# EAGLE design Adafruit EZ-Link Shield v1.1 (EAGLE 6.3)
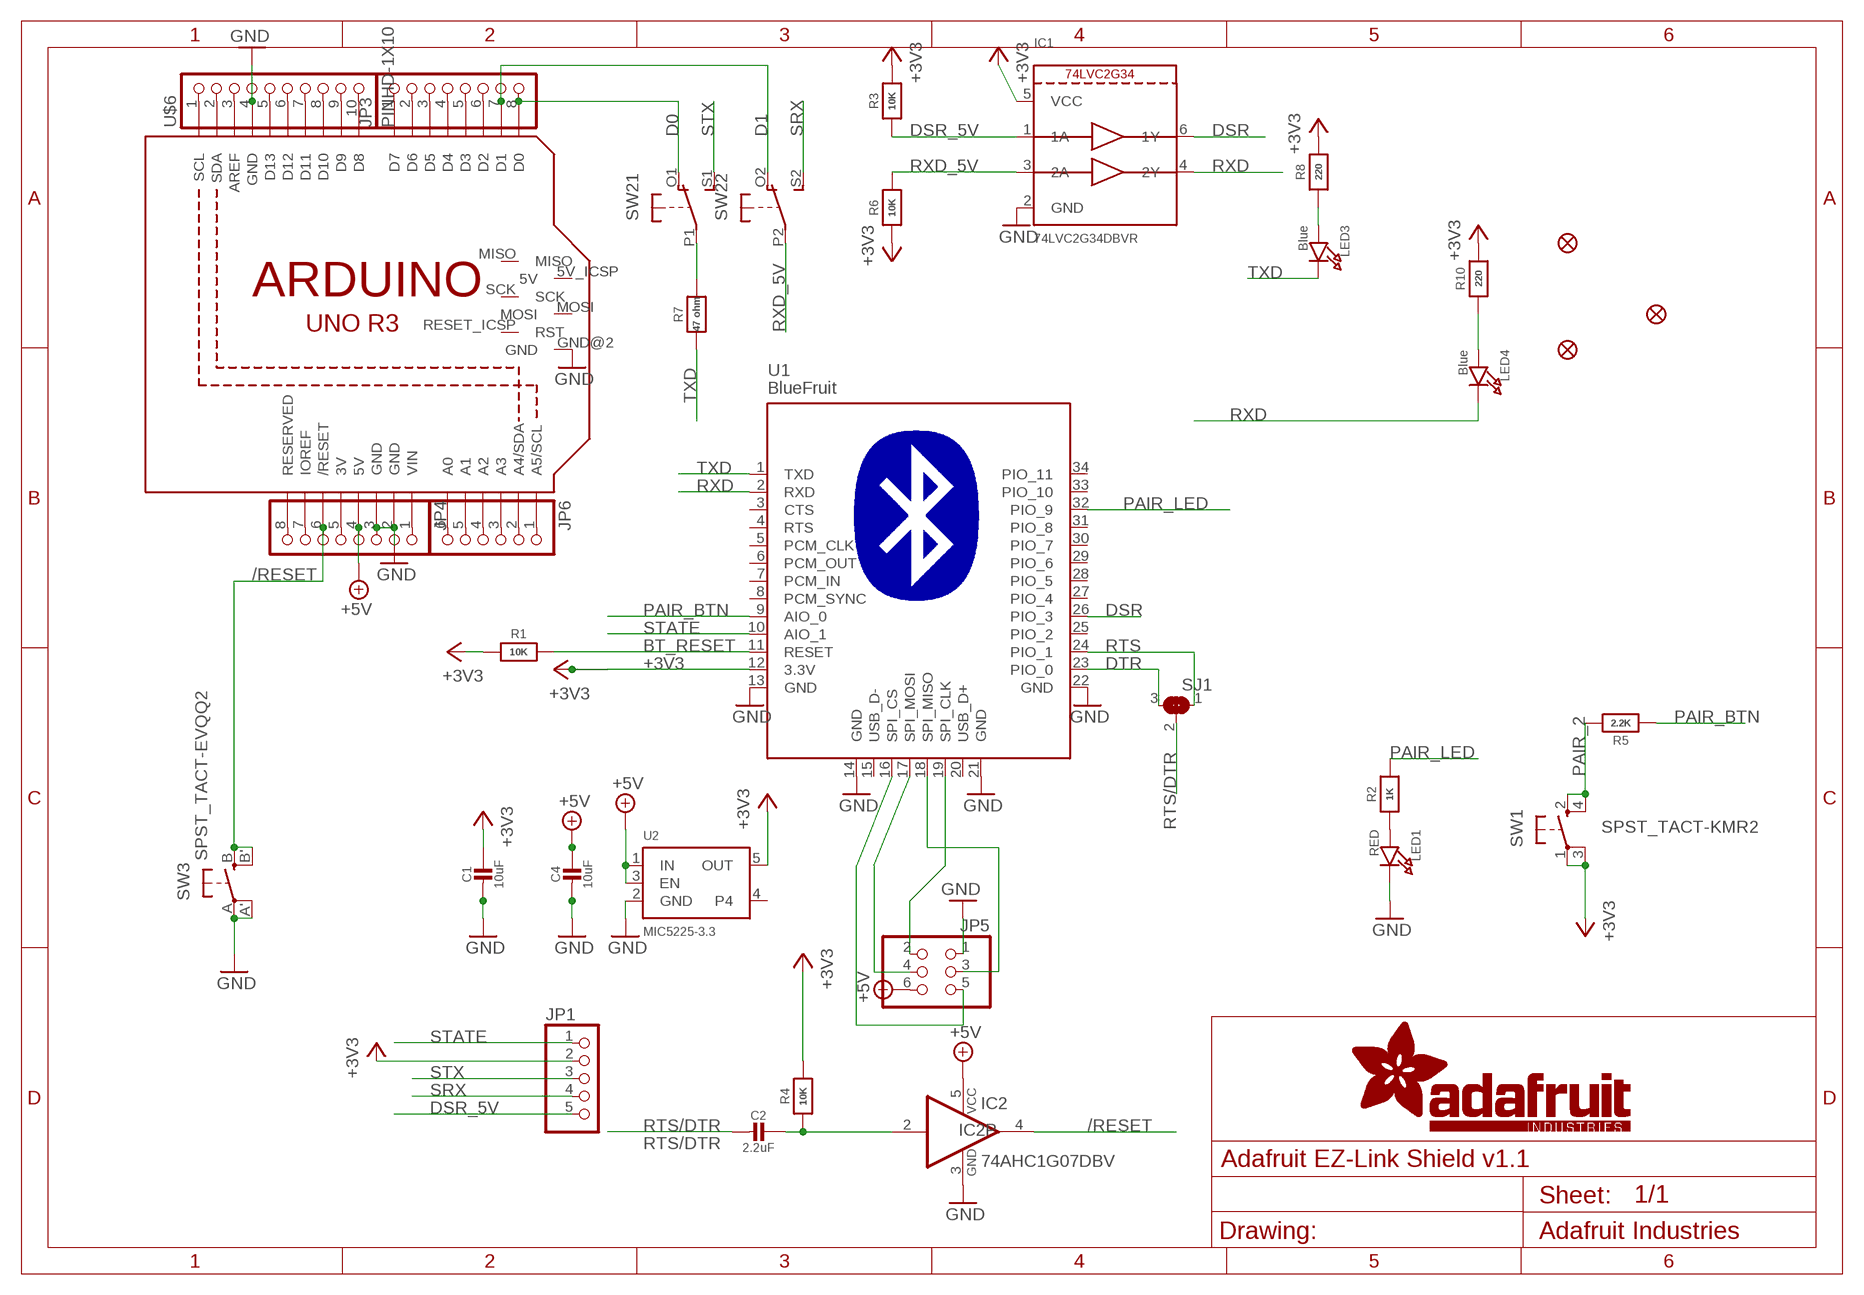
[diagram p0: schematic, sheet 1]

## Parts
C1  10uF  CAP_CERAMIC0805-NOOUTLINE  [0805-NO]
C2  2.2uF  CAP_CERAMIC0805-NOOUTLINE  [0805-NO]
C4  10uF  CAP_CERAMIC0805-NOOUTLINE  [0805-NO]
FID1  FIDUCIAL""  [FIDUCIAL_1MM]
FID2  FIDUCIAL""  [FIDUCIAL_1MM]
FID3  FIDUCIAL""  [FIDUCIAL_1MM]
IC1  74LVC2G34DBVR  [SOT23-6]
IC2  74AHC1G07DBV  [SOT23-5]
JP1  HEADER-1X570MIL  [1X05_ROUND_70]
JP3  PINHD-1X8BIG  [1X08-BIG]
JP4  PINHD-1X8BIG  [1X08-BIG]
JP5  HEADER-2X3  [2X03_ROUND_70MIL]
JP6  PINHD-1X6B  [1X06-BIG]
LED1  RED  LED0805_NOOUTLINE  [CHIPLED_0805_NOOUTLINE]
LED3  Blue  LED0805_NOOUTLINE  [CHIPLED_0805_NOOUTLINE]
LED4  Blue  LED0805_NOOUTLINE  [CHIPLED_0805_NOOUTLINE]
R1  10K  RESISTOR0805_NOOUTLINE  [0805-NO]
R2  1K  RESISTOR0805_NOOUTLINE  [0805-NO]
R3  10K  RESISTOR_0805MP  [_0805MP]
R4  10K  RESISTOR0805_NOOUTLINE  [0805-NO]
R5  2.2K  RESISTOR0805_NOOUTLINE  [0805-NO]
R6  10K  RESISTOR_0805MP  [_0805MP]
R7  47 ohm  RESISTOR0805_NOOUTLINE  [0805-NO]
R8  220  RESISTOR0805_NOOUTLINE  [0805-NO]
R10  220  RESISTOR0805_NOOUTLINE  [0805-NO]
SJ1  SOLDERJUMPER_2WAY  [SOLDERJUMPER_2WAY_OPEN_NOPASTE]
SW1  SPST_TACT-KMR2  [KMR2]
SW2  DPDT-EG1390  [EG1390]
SW3  SPST_TACT-EVQQ2  [EVQ-Q2]
U1  BlueFruit  BLUETOOTH_MODULE  [BLUETOOTH_MODULE]
U2  MIC5225-3.3  VREG_SOT23-5  [SOT23-5]
U$5  ARDUINO_R3_ICSP  [ARDUINOR3_ICSP]
U$6  PINHD-1X10  [1X10-BIG]

## Nets
+3V3: C1.1 IC1.5(VCC) JP1.2 R1.1 R3.2 R4.2 R6.1 R8.2 R10.2 SW1.1(P) SW1.3(P1) U1.12(3.3V) U2.5(OUT)
+5V: C4.1 IC2.5(VCC) JP4.4 JP5.6 U2.1(IN) U2.3(EN) U$5.5V
/RESET: IC2.4(O) JP4.6 SW3.B'(S1) SW3.B(S) U$5.RESET(/RESET)
BT_RESET: R1.2 U1.11(RESET)
D0: JP3.8 SW2.O1(1:O) U$5.D0
D1: JP3.7 SW2.O2(2:O) U$5.D1
DSR: IC1.6(1Y) U1.26(PIO_3)
DSR_5V: IC1.1(1A) JP1.5 R3.1
DTR: SJ1.3 U1.23(PIO_0)
GND: C1.2 C4.2 IC1.2(GND) IC2.3(GND) JP4.2 JP4.3 JP5.1 LED1.C SW3.A'(P1) SW3.A(P) U1.13(GND) U1.14(GND) U1.21(GND) U1.22(GND) U2.2(GND) U$5.GND U$5.GND@1(GND) U$5.GND@2(GND) U$5.GND@3(GND) U$6.4
N$1: C2.1 IC2.2(I) R4.1
N$2: LED1.A R2.1
N$3: R7.2 SW2.P1(1:P)
N$4: JP3.1 U$5.D7
N$5: JP3.2 U$5.D6
N$6: LED3.A R8.1
N$8: JP3.3 U$5.D5
N$9: JP3.4 U$5.D4
N$10: LED4.A R10.1
N$11: JP3.5 U$5.D3
N$12: JP3.6 U$5.D2
N$13: JP4.1 U$5.VIN
N$14: JP4.5 U$5.3V
N$15: JP4.7 U$5.IOREF
N$16: JP4.8 U$5.RESERVED
N$17: JP6.1 U$5.A5(A5/SCL)
N$18: JP6.2 U$5.A4(A4/SDA)
N$19: JP6.3 U$5.A3
N$20: JP6.4 U$5.A2
N$21: JP6.5 U$5.A1
N$22: JP6.6 U$5.A0
N$23: U$5.SCL U$6.1
N$24: U$5.SDA U$6.2
N$25: U$5.AREF U$6.3
N$27: U$5.D13 U$6.5
N$28: U$5.D12 U$6.6
N$29: U$5.D11 U$6.7
N$30: U$5.D10 U$6.8
N$31: U$5.D9 U$6.9
N$32: U$5.D8 U$6.10
PAIR_2: R5.2 SW1.2(S) SW1.4(S1)
PAIR_BTN: R5.1 U1.9(AIO_0)
PAIR_LED: R2.2 U1.32(PIO_9)
RTS: SJ1.1 U1.24(PIO_1)
RTS/DTR: C2.2 SJ1.2
RXD: IC1.4(2Y) LED4.C U1.2(RXD)
RXD_5V: IC1.3(2A) R6.2 SW2.P2(2:P)
SPI_CLK: JP5.2 U1.19(SPI_CLK)
SPI_CS: JP5.5 U1.16(SPI_CS)
SPI_MISO: JP5.3 U1.18(SPI_MISO)
SPI_MOSI: JP5.4 U1.17(SPI_MOSI)
SRX: JP1.4 SW2.S2(2:S)
STATE: JP1.1 U1.10(AIO_1)
STX: JP1.3 SW2.S1(1:S)
TXD: LED3.C R7.1 U1.1(TXD)
Unconnected: U1.3(CTS) U1.4(RTS) U1.5(PCM_CLK) U1.6(PCM_OUT) U1.7(PCM_IN) U1.8(PCM_SYNC) U1.15(USB_D-) U1.20(USB_D+) U1.25(PIO_2) U1.27(PIO_4) U1.28(PIO_5) U1.29(PIO_6) U1.30(PIO_7) U1.31(PIO_8) U1.33(PIO_10) U1.34(PIO_11) U2.4 U$5.5V_ICSP(5V) U$5.MISO U$5.MOSI U$5.RESET_ICSP(RST) U$5.SCK

## Library data of the parts
C1 C2 C4 = microbuilder:CAP_CERAMIC: Ceramic Capacitors For new designs, use the packages preceded by an '_' character since they are more reliable: The following footprints should be used on most boards: _0402 - Standard footprint for regular board layouts _0603 - Standard footprint for regular board layouts _0805 - Standard footprint for regular board layouts _1206 - Standard footprint for regular board layouts For extremely tight-pitch boards where space is at a premium, the following 'micro-pitch' footprints can be used (smaller pads, no silkscreen outline, etc.): _0402MP - Micro-pitch footprint for very dense/compact boards _0603MP - Micro-pitch footprint for very dense/compact boards _0805MP - Micro-pitch footprint for very dense/compact boards _1206MP - Micro-pitch footprint for very dense/compact boards
FID1-FID3 = microbuilder:FIDUCIAL: Fiducial Alignment Points Various fiducial points for machine vision alignment.; BOM: EXCLUDE
IC1 = microbuilder:74LVC2G34
IC2 = 74xx-little-us:74*1G07: Single Buffer/Driver With Open-Drain Output
JP1 = microbuilder:HEADER-1X5: PIN HEADER
JP3 JP4 = adafruit:PINHD-1X8: PIN HEADER
JP5 = microbuilder:HEADER-2X3: PIN HEADER
JP6 = adafruit:PINHD-1X6: PIN HEADER
LED1 LED3 LED4 = microbuilder:LED: LED 0603 - 0603 Surface Mount Package 2mA: Green LED - Low Power (3.9mcd, 2ma, 1.7Vf) - Digikey: 475-2709-2-ND Orange LED - Low Power (9.8mcd, 2ma, 1.8Vf) - Digikey: 475-1194-2-ND Red LED - Low Power (5mcd, 2ma, 1.8Vf) - Digikey: 475-1195-2-ND Yellow LED - Low Power (7mcd, 2ma, 1.8Vf) - Digikey: 475-1196-2-ND 5mA: Blue LED - Low Power (17mcd, 5ma, 2.9Vf) - Digikey: LNJ937W8CRACT-ND 0805 - 0805 Surface Mount Package 2mA: Red LED (8.8mcd, 2mA, 1.8Vf, Clear) - Low Power [Digikey: 475-2510-1-ND] Green LED (5mcd, 2mA, 1.8Vf, Clear) - Low Power [Digikey: 475-2730-1-ND] Yellow LED (11.3mcd, 2mA, 1.8Vf, Clear) - Low Power [Digikey: 475-2555-1-ND] 20mA: Red LED (104mcd, 20mA, Diffused) - LS R976 [Digikey: 475-1278-6-ND] Red LED (12mcd, 20mA, 2.0Vf, Clear) - APT2012EC [Digikey: 754-1128-1-ND] Green LED (15mcd, 20mA, 2.2Vf, Clear) - APT2012GC [Digikey: 754-1131-1-ND] Orange LED (160mcd, 20mA, 2.1Vf, Clear) - APT2012SECK [Digikey: 754-1130-1-ND] 1206 - 1206 Surface Mount Package Green LED (26mcd, 20mA, Diffused) - LG N971 [Digikey: 475-1407-6-ND] Red LED (15mcd, 20mA, Diffused) - LH N974 [Digikey: 475-1416-6-ND] Cree - Cree High-Power Surface Mount LEDs XPEBWT-L1-0000-00D50 - White 111lm 350mA 2.9Vf 6200K 110° XTEAWT-00-0000-00000LEE3 - White 114lm 350mA 2.85Vf 5000K 115° Everlight - Everlight 45-21 Series Surface Mount LEDs 45-21/QK2C-B2832AC2CB2/2T - Warm White 2000mcd 20mA 3.25Vf 3050K 120° 45-21/LK2C-B38452C4CB2/2T - Nuetral White 2000mcd 20mA 3.25Vf 4150K 120° 45-21/LK2C-B50634C6CB2/2T - Cold White 2200mcd 20mA 3.25Vf 5650K 120° PLCC2 Reverse Mount LS T77K-J1L2-1-0-2-R18-Z - Red 11.25mcd 2mA 1.8Vf 630nm 120° LO T77K-L1M2-24-Z - Orange 19.6mcd 2mA 1.8Vf 606nm 120° LY T77K-K2M1-26-Z - Yellow 15.7mcd 2mA 1.8Vf 587nm 120°
R1-R8 R10 = microbuilder:RESISTOR: Resistors For new designs, use the packages preceded by an '_' character since they are more reliable: The following footprints should be used on most boards: _0402 - Standard footprint for regular board layouts _0603 - Standard footprint for regular board layouts _0805 - Standard footprint for regular board layouts _1206 - Standard footprint for regular board layouts For extremely tight-pitch boards where space is at a premium, the following 'micro-pitch' footprints can be used (smaller pads, no silkscreen outline, etc.): _0402MP - Micro-pitch footprint for very dense/compact boards _0603MP - Micro-pitch footprint for very dense/compact boards _0805MP - Micro-pitch footprint for very dense/compact boards _1206MP - Micro-pitch footprint for very dense/compact boards
SJ1 = microbuilder:SOLDERJUMPER_2WAY: 2-Way Solder Jumper
SW1 SW3 = adafruit:SPST_TACT: SMT 6mm switch, EVQQ2 series http://www.ladyada.net/library/eagle
SW2 = adafruit:DPDT
U1 = microbuilder:BLUETOOTH_MODULE: BLUETOOTH MODULE
U2 = microbuilder:VREG_SOT23-5: SOT23-5 Fixed Voltage Regulators Part Current Out V Out V In V Dropout θJA (°C/W) TJ (°C) Digikey Part No. ADP121 150mA 3.3V 3.4-5.5V 0.09V @ 150mA -- -- ADP121-AUJZ33R7CT-ND ADP121 150mA 3.0V 3.1-5.5V 0.09V @ 150mA -- -- ADP121-AUJZ30R7CT-ND ADP122 300mA 3.3V 3.4-5.5V 0.085V @ 300mA -- -- ADP122AUJZ-3.3-R7CT-ND ADP1712 300mA 3.3V 3.5-5.5V 0.17V @ 300mA -- -- ADP1712AUJZ-3.3-R7TR-ND AP7311 (Low Cost) 150mA 3.3V 3.5-6V 0.15V @ 150mA -- -- AP7311-33WG-7DICT-ND LD39015M18R 150mA 1.8V 1.9V-5.5V 0.08V @ 100mA -- -- 497-6977-1-ND LP2985A-33DBVR 150mA 3.3V 3.3-16V 0.28V @ 150mA 206 150 296-18479-1-ND MCP1824T-3302E/OT 300mA 3.3V 3.5V-6V 0.2V @ 300mA -- -- MCP1824T-3302E/OTCT-ND MIC5205-2.5YM5 TR 150mA 2.5V 2.7-16V 0.165V @ 150mA -- -- 576-1257-2-ND MIC5205-3.0YM5 TR 150mA 3.0V 3.2V-16V 0.165V @ 150mA -- -- 576-1258-2-ND MIC5205-3.3YM5 TR 150mA 3.3V 3.5V-16V 0.165V @ 150mA -- -- 576-1259-2-ND TPS780330220 150mA 3.3V+2.2V 3.6-5.5V 250mV Max -- -- 296-23332-1-ND TDA3663/N1,135 100mA 3.3V 3.5-45V 0.18V @ 50mA -- -- 568-5343-1-ND Max operating temp can be calculated using θJA, TJ (max junction temperature), and power in watts. Set the "Maximum Ambient Temperature" until it reaches TJ ("Max Junction Temperature"), which is the absolute limit for safe use of the regulator: Heat Sink Temperature Calculator <http://www.daycounter.com/Calculators/Heat-Sink-Temperature-Calculator.phtml> For example, With 12V source into a 3.3V LP2985 and a 30mA load, we are dissipating (12V-3.3V) * 0.03A = 0.261W. With a θJA of 206 °C/W, a TJ of 150°C, and 261mW we can safely use the chip without a heat sink up to 75°C (=147.1°C Junction Temperature).
U$5 = adafruit2:ARDUINO_R3_ICSP
U$6 = adafruit:PINHD-1X10: Pin header 1x10 0.1" spacing With round pins

## Board
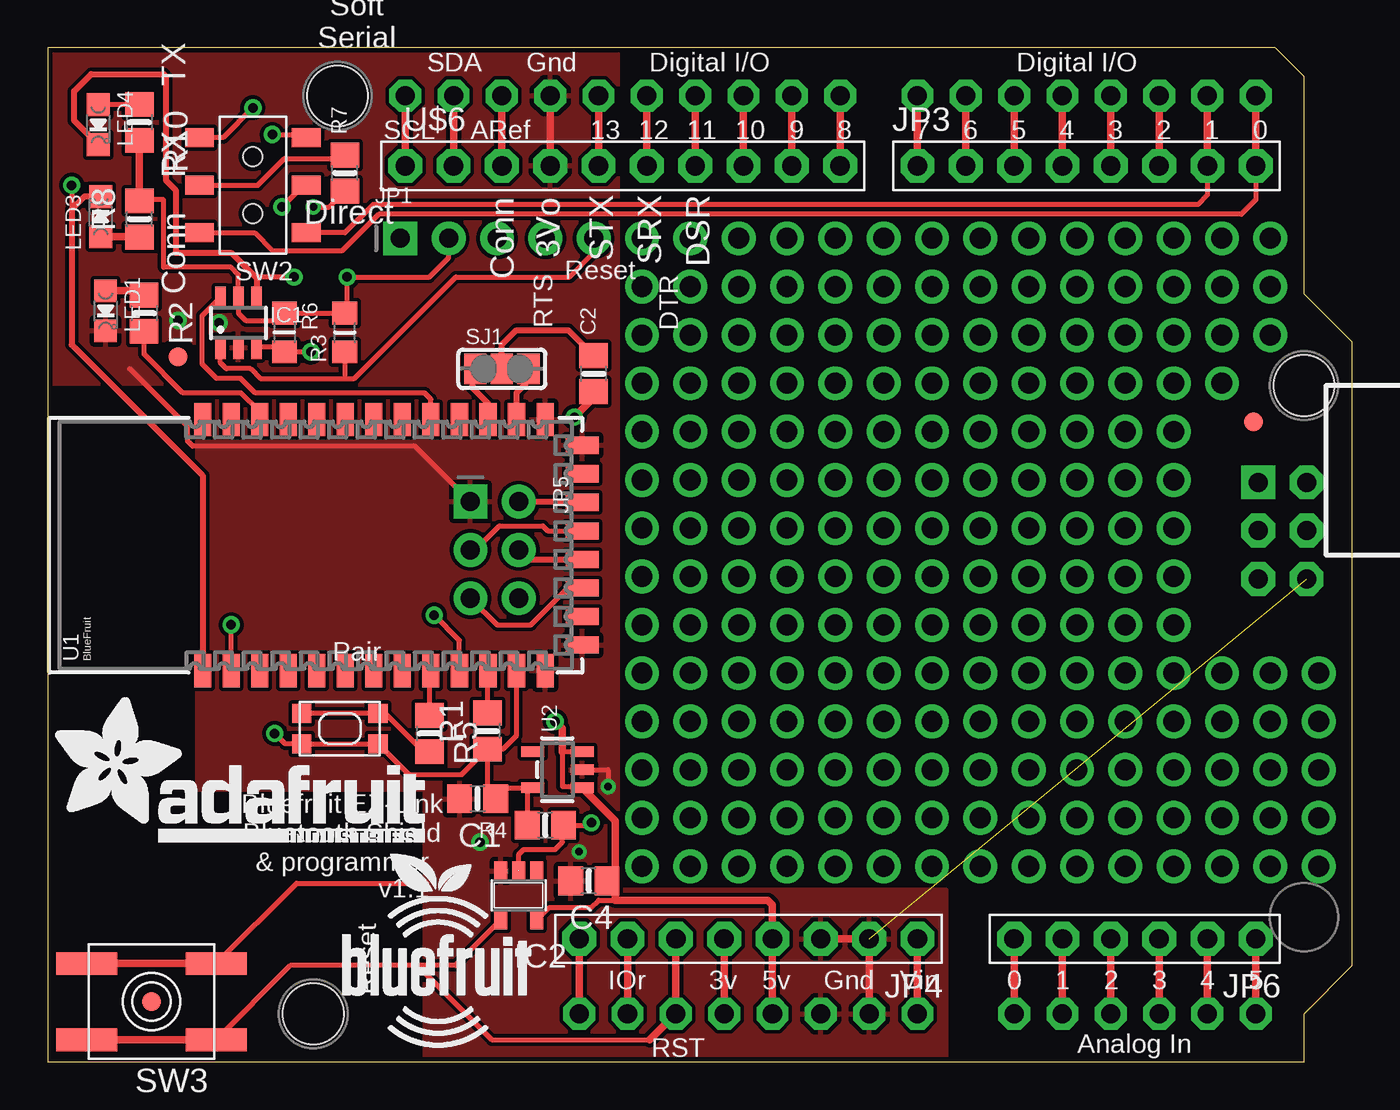
[diagram p1: board, top side]
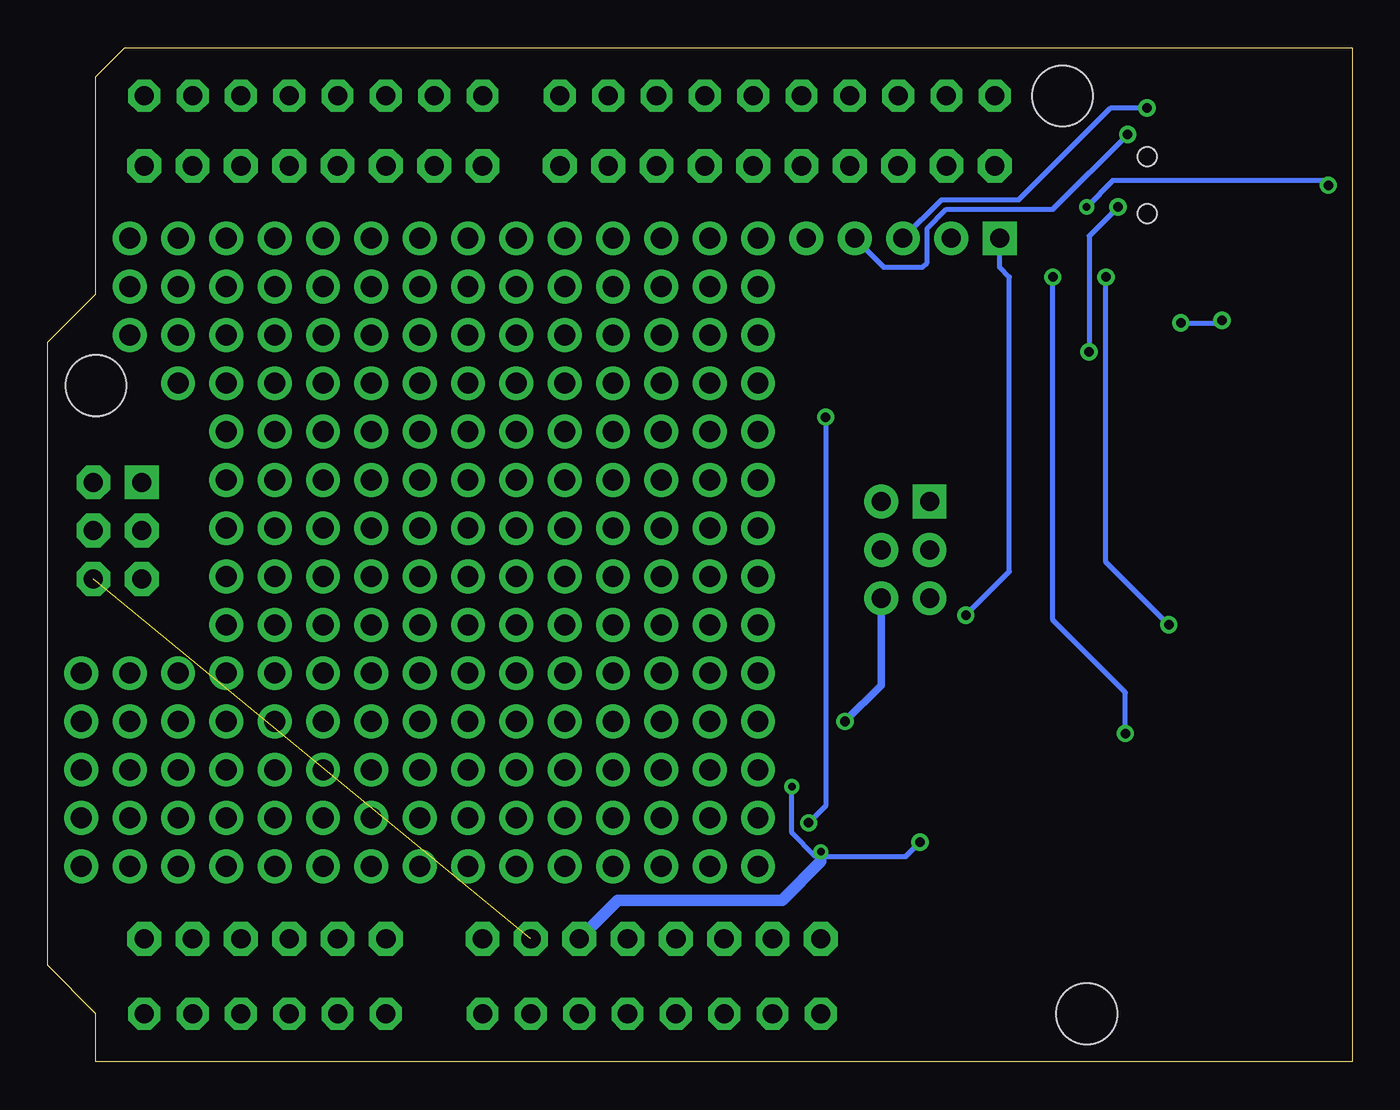
[diagram p2: board, bottom side, seen from below]

Size 68.58 x 53.34 mm. Coordinates in mm from the lower left corner, seen from the top.
Copper layers (1*16): Top 0.035mm / dielectric 1.5mm / Bottom 0.035mm
Design rules "adafruit *": minimum track width 8mil, minimum drill 15.5mil, track to track 8mil, track to pad 8mil, pad to pad 8mil, via to via 8mil, smd to smd 8mil, copper to edge 10mil, drill to drill 8mil, minimum pad ring 10mil, minimum via ring 8mil, stop-mask expansion 4mil, vias tented up to drill 20mil, thermal gap 10mil
Holes 3.2 mm at 66.04,35.56 15.24,50.8 13.97,2.54

### Footprints (pad centres in the part's own frame; a part is rotated, then mirrored left to right if it is on the bottom)
0805-NO = smd 1.3 x 1.5: 1 -0.95,0; 2 0.95,0
FIDUCIAL_1MM = smd 1 x 1: 1 0,0
SOT23-6 = smd 0.55 x 1.2: 1 -0.95,-1.3; 2 0,-1.3; 3 0.95,-1.3; 4 0.95,1.3; 5 0,1.3; 6 -0.95,1.3
SOT23-5 = smd 0.69 x 0.99: 1 -0.95,-1.29; 2 0,-1.29; 3 0.95,-1.29; 4 0.95,1.3; 5 -0.95,1.3
1X05_ROUND_70 = drill 1 pad 1.778 square: 1 -5.08,0 | drill 1 pad 1.778: 2 -2.54,0; 3 0,0; 4 2.54,0; 5 5.08,0
1X08-BIG = drill 1.016 pad 1.778 octagon: 1 -8.89,0; 2 -6.35,0; 3 -3.81,0; 4 -1.27,0; 5 1.27,0; 6 3.81,0; 7 6.35,0; 8 8.89,0
2X03_ROUND_70MIL = drill 1 pad 1.778 square: 1 -2.54,-1.27 | drill 1 pad 1.778: 2 -2.54,1.27; 3 0,-1.27; 4 0,1.27; 5 2.54,-1.27; 6 2.54,1.27
1X06-BIG = drill 1.016 pad 1.778 octagon: 1 -6.35,0; 2 -3.81,0; 3 -1.27,0; 4 1.27,0; 5 3.81,0; 6 6.35,0
CHIPLED_0805_NOOUTLINE = smd 1.2 x 1.2: A 0,-1.05; C 0,1.05
_0805MP = smd 1.2 x 1.3: 1 -1.016,0; 2 1.016,0
SOLDERJUMPER_2WAY_OPEN_NOPASTE = smd 1.168 x 1.6: 1 -1.397,0; 2 0,0; 3 1.397,0
KMR2 = smd 1 x 1: 1 2,0.8; 2 2,-0.8; 3 -2,0.8; 4 -2,-0.8
EG1390 = smd 1 x 1.5: O1 -2.5,2.8; O2 -2.5,-2.8; P1 0,2.8; P2 0,-2.8; S1 2.5,2.8; S2 2.5,-2.8 | hole 1: 1.5,0; -1.5,0
EVQ-Q2 = smd 3.2 x 1.2: A -3.4,-2; A' 3.4,-2; B -3.4,2; B' 3.4,2
BLUETOOTH_MODULE = smd 1.75 x 0.9: 1 -6.6,5.95; 2 -6.6,4.45; 3 -6.6,2.95; 4 -6.6,1.45; 5 -6.6,-0.05; 6 -6.6,-1.55; 7 -6.6,-3.05; 8 -6.6,-4.55; 9 -6.6,-6.05; 10 -6.6,-7.55; 11 -6.6,-9.05; 12 -6.6,-10.55; 13 -6.6,-12.05; 22 6.6,-12.05; 23 6.6,-10.55; 24 6.6,-9.05; 25 6.6,-7.55; 26 6.6,-6.05; 27 6.6,-4.55; 28 6.6,-3.05; 29 6.6,-1.55; 30 6.6,-0.05; 31 6.6,1.45; 32 6.6,2.95; 33 6.6,4.45; 34 6.6,5.95 | smd 0.9 x 1.75: 14 -5.25,-14; 15 -3.75,-14; 16 -2.25,-14; 17 -0.75,-14; 18 0.75,-14; 19 2.25,-14; 20 3.75,-14; 21 5.25,-14
SOT23-5' = smd 0.55 x 1.2: 1 -0.95,-1.3; 2 0,-1.3; 3 0.95,-1.3; 4 0.95,1.3; 5 -0.95,1.3
ARDUINOR3_ICSP = drill 1 pad 1.676 octagon: 3V 35.56,2.54; 5V 38.1,2.54; A0 50.8,2.54; A1 53.34,2.54; A2 55.88,2.54; A3 58.42,2.54; A4 60.96,2.54; A5 63.5,2.54; AREF 23.876,50.8; D0 63.5,50.8; D1 60.96,50.8; D2 58.42,50.8; D3 55.88,50.8; D4 53.34,50.8; D5 50.8,50.8; D6 48.26,50.8; D7 45.72,50.8; D8 41.656,50.8; D9 39.116,50.8; D10 36.576,50.8; D11 34.036,50.8; D12 31.496,50.8; D13 28.956,50.8; GND 26.416,50.8; GND@1 43.18,2.54; GND@2 40.64,2.54; IOREF 30.48,2.54; RESERVED 27.94,2.54; RESET 33.02,2.54; SCL 18.796,50.8; SDA 21.336,50.8; VIN 45.72,2.54 | drill 1 pad 1.778 octagon: 5V_ICSP 66.167,30.48; GND@3 66.167,25.4; MOSI 66.167,27.94; RESET_ICSP 63.627,25.4; SCK 63.627,27.94 | drill 1 pad 1.778 square: MISO 63.627,30.48
1X10-BIG = drill 1.016 pad 1.778 octagon: 1 -11.43,0; 2 -8.89,0; 3 -6.35,0; 4 -3.81,0; 5 -1.27,0; 6 1.27,0; 7 3.81,0; 8 6.35,0; 9 8.89,0; 10 11.43,0

### Placement (x,y rotation side)
C1  22.61,13.84 180 top
C2  28.7,36.2 90 top
C4  28.45,9.52 180 top
FID1  5.46,3.17 0 top
FID2  63.37,33.66 0 top
FID3  6.86,37.08 0 top
IC1  10.03,38.86 0 top
IC2  24.77,8.76 180 top
JP1  23.62,43.31 0 top
JP3  54.61,47.12 0 top
JP4  36.83,6.48 180 top
JP5  23.49,26.92 270 top
JP6  57.15,6.48 180 top
LED1  3.05,39.5 180 top
LED3  2.79,44.45 0 top
LED4  2.67,49.28 180 top
R1  23.11,17.4 90 top
R2  5.08,39.37 270 top
R3  15.62,38.35 90 top
R4  26.16,12.45 180 top
R5  20.07,17.27 270 top
R6  12.45,38.35 270 top
R7  15.62,46.74 90 top
R8  4.83,44.32 90 top
R10  4.83,49.4 270 top
SJ1  23.88,36.45 0 top
SW1  15.37,17.53 180 top
SW2  10.79,46.1 90 top
SW3  5.46,3.17 180 top
U1  14.1,27.18 90 top
U2  MIC5225-3.3  [SOT23-5']  26.8,15.37 90 top
U$4  [BLUEFRUITLOGO_100MM]  15.49,0.76 0 top
U$5  0,0 0 top
U$6  30.23,47.12 0 top
U$7  [ADAFRUIT_TEXT_20MM]  0.25,11.56 0 top

### Tracks (layer width: path | path; a pad name or v marks a point on that pad's centre or on a via)
+3V3  (via drill 0.5)
  Top 0.254: R1.1 21.78,15.11 18.98,15.11 SW1.3 SW1.1 12.48,16.73 v11.94,17.27 | R1.1 23.11,14.29 C1.1 | C1.1 24.13,14.42 U2.5 25.21,14.42 R4.2 | U1.12 24.64,20.57 24.64,17.14 23.94,16.45 R1.1 | JP1.2 21.08,42.29 20.07,41.27 v15.75,41.27 15.75,39.5 R3.2 R6.1 12.07,38.99 10.41,38.99 10.03,39.37 IC1.5 10.03,41.4 9.65,41.78 6.1,41.78 6.1,45.34 4.89,45.34 R8.2 | 23.56,13.65 C1.1
  Top 0.406: R10.2 R8.2
  Bottom 0.254: v11.94,17.27 11.94,19.43 15.75,23.24 v15.75,41.27
+5V  (via drill 0.5)
  Top 0.254: U2.3 27.05,16.32 27.05,14.48 28.1,14.48 U2.1 | IC2.5 26.38,8.13 28.58,8.13 28.96,8.51 29.84,8.51 | C4.1 29.65,9.27 29.84,9.27
  Top 0.406: U$5.5V JP4.4 38.1,8.25 37.85,8.51 29.84,8.51 29.84,9.27 29.84,12.67 U2.1 | v26.67,17.91 27.05,17.53 27.05,16.32
  Bottom 0.406: JP5.6 24.77,19.81 v26.67,17.91
/RESET
  Top 0.254: SW3.B 12.77,5.08 19.43,5.08 | 31.66,1.17 23.34,1.17 19.43,5.08 | IC2.4 21.43,5.08 19.43,5.08
  Top 0.406: JP4.6 U$5.RESET 31.66,1.17 | SW3.B' SW3.B
BT_RESET
  Top 0.254: R1.2 23.15,18.38 U1.11
D0
  Top 0.254: JP3.8 63.5,45.34 62.74,44.58 17.4,44.58 15.49,42.67 11.81,42.67 10.88,43.6 SW2.O1
  Top 0.406: U$5.D0 JP3.8
D1
  Top 0.254: JP3.7 60.96,45.59 60.45,45.08 17.11,45.08 15.63,43.6 SW2.O2
  Top 0.406: U$5.D1 JP3.7
DSR
  Top 0.254: U1.26 20.15,34.84 19.81,35.18 10.92,35.18 10.16,35.94 8.89,35.94 8.13,36.7 8.13,39.24 8.89,40 8.89,39.97 IC1.6
DSR_5V
  Top 0.254: 15.62,35.94 11.18,35.94 10.67,36.45 9.4,36.45 9.08,36.76 IC1.1 | 15.62,35.94 16.13,35.94 21.46,41.27 27.43,41.27 28.7,42.54 JP1.5 | R3.1 15.62,35.94
DTR
  Top 0.305: U1.23 24.65,35.19 25.15,35.69 25.15,36.32 SJ1.3
GND  (via drill 0.39, 0.5)  (1 unrouted)
  Top 0.254: JP5.1 19.3,32.38 7.62,32.38 7.37,32.64 7.37,33.4 4.32,36.45 | v6.86,38.99 6.6,38.99 | SW3.A 13.08,9.4 19.94,9.4 | U2.2 29.46,15.37 v29.46,14.48 | v22.73,11.56 22.73,11.81 22.86,11.94
  Top 0.406: U$5.GND U$6.4 | U$5.GND@1 JP4.2 JP4.3 | SW3.A' SW3.A
  Bottom 0.254: v9.02,38.86 7.24,38.86 7.11,38.99 v6.86,38.99 | 28.19,10.79 23.49,10.79 v22.73,11.56 | 28.19,10.79 29.46,12.07 v29.46,14.48 | 28.19,10.79 v27.94,11.05
  Bottom 0.61: JP4.3 38.61,8.51 29.97,8.51 27.94,10.54 v27.94,11.05
  pour Top: 0,53.47 0,35.69 7.87,35.69 7.87,14.35 19.81,14.35 19.81,0.13 47.24,0.13 47.24,9.02 29.97,9.02 29.97,53.47
N$1  (via drill 0.5)
  Top 0.254: IC2.2 24.77,10.92 25.02,11.18 26.67,11.18 27.05,11.56 27.05,12.39 R4.1 28.45,12.45 v28.58,12.57
  Top 0.406: C2.1 28.7,34.92 v27.69,33.91
  Bottom 0.254: v27.69,33.91 27.69,13.46 v28.58,12.57
N$2
  Top 0.406: LED1.A 4.85,40.55 R2.1
N$3
  Top 0.254: SW2.P1 11.05,46.1 12.45,47.5 15.43,47.5 R7.2
N$4
  Top 0.406: U$5.D7 JP3.1
N$5
  Top 0.406: U$5.D6 JP3.2
N$6
  Top 0.406: LED3.A 4.8,43.4 R8.1
N$8
  Top 0.406: U$5.D5 JP3.3
N$9
  Top 0.406: U$5.D4 JP3.4
N$10
  Top 0.254: R10.1 4.8,50.33 LED4.A
N$11
  Top 0.406: U$5.D3 JP3.5
N$12
  Top 0.406: U$5.D2 JP3.6
N$13
  Top 0.406: U$5.VIN JP4.1
N$14
  Top 0.406: U$5.3V JP4.5
N$15
  Top 0.406: U$5.IOREF JP4.7
N$16
  Top 0.406: U$5.RESERVED JP4.8
N$17
  Top 0.406: U$5.A5 JP6.1
N$18
  Top 0.406: JP6.2 U$5.A4
N$19
  Top 0.406: JP6.3 U$5.A3
N$20
  Top 0.406: JP6.4 U$5.A2
N$21
  Top 0.406: JP6.5 U$5.A1
N$22
  Top 0.406: JP6.6 U$5.A0
N$23
  Top 0.406: U$5.SCL U$6.1
N$24
  Top 0.406: U$5.SDA U$6.2
N$25
  Top 0.406: U$5.AREF U$6.3
N$26  (via drill 1.1 pad 1.78)
  other vias: 59.18,43.31
N$27
  Top 0.406: U$5.D13 U$6.5
N$28
  Top 0.406: U$5.D12 U$6.6
N$29
  Top 0.406: U$5.D11 U$6.7
N$30
  Top 0.406: U$5.D10 U$6.8
N$31
  Top 0.406: U$5.D9 U$6.9
N$32
  Top 0.406: U$5.D8 U$6.10
N$33  (via drill 1.1 pad 1.78)
  other vias: 59.18,40.77
N$34  (via drill 1.1 pad 1.78)
  other vias: 59.18,38.23
N$35  (via drill 1.1 pad 1.78)
  other vias: 59.18,35.69
N$36  (via drill 1.1 pad 1.78)
  other vias: 59.18,33.15
N$37  (via drill 1.1 pad 1.78)
  other vias: 59.18,30.61
N$38  (via drill 1.1 pad 1.78)
  other vias: 59.18,28.07
N$39  (via drill 1.1 pad 1.78)
  other vias: 59.18,25.53
N$40  (via drill 1.1 pad 1.78)
  other vias: 59.18,22.99
N$41  (via drill 1.1 pad 1.78)
  other vias: 59.18,20.45
N$42  (via drill 1.1 pad 1.78)
  other vias: 59.18,15.37
N$43  (via drill 1.1 pad 1.78)
  other vias: 59.18,17.91
N$44  (via drill 1.1 pad 1.78)
  other vias: 59.18,12.83
N$45  (via drill 1.1 pad 1.78)
  other vias: 59.18,10.29
N$46  (via drill 1.1 pad 1.78)
  other vias: 61.72,10.29
N$47  (via drill 1.1 pad 1.78)
  other vias: 64.26,10.29
N$48  (via drill 1.1 pad 1.78)
  other vias: 64.26,12.83
N$49  (via drill 1.1 pad 1.78)
  other vias: 61.72,12.83
N$50  (via drill 1.1 pad 1.78)
  other vias: 61.72,15.37
N$51  (via drill 1.1 pad 1.78)
  other vias: 66.8,15.37
N$52  (via drill 1.1 pad 1.78)
  other vias: 66.8,12.83
N$53  (via drill 1.1 pad 1.78)
  other vias: 66.8,10.29
N$54  (via drill 1.1 pad 1.78)
  other vias: 64.26,15.37
N$55  (via drill 1.1 pad 1.78)
  other vias: 66.8,17.91
N$56  (via drill 1.1 pad 1.78)
  other vias: 64.26,17.91
N$57  (via drill 1.1 pad 1.78)
  other vias: 61.72,17.91
N$58  (via drill 1.1 pad 1.78)
  other vias: 61.72,20.45
N$59  (via drill 1.1 pad 1.78)
  other vias: 64.26,20.45
N$60  (via drill 1.1 pad 1.78)
  other vias: 66.8,20.45
N$63  (via drill 1.1 pad 1.78)
  other vias: 61.72,35.69
N$64  (via drill 1.1 pad 1.78)
  other vias: 61.72,38.23
N$65  (via drill 1.1 pad 1.78)
  other vias: 64.26,38.23
N$66  (via drill 1.1 pad 1.78)
  other vias: 64.26,40.77
N$67  (via drill 1.1 pad 1.78)
  other vias: 61.72,40.77
N$68  (via drill 1.1 pad 1.78)
  other vias: 61.72,43.31
N$69  (via drill 1.1 pad 1.78)
  other vias: 64.26,43.31
N$70  (via drill 1.1 pad 1.78)
  other vias: 56.64,43.31
N$71  (via drill 1.1 pad 1.78)
  other vias: 56.64,40.77
N$72  (via drill 1.1 pad 1.78)
  other vias: 56.64,38.23
N$73  (via drill 1.1 pad 1.78)
  other vias: 56.64,35.69
N$74  (via drill 1.1 pad 1.78)
  other vias: 56.64,30.61
N$75  (via drill 1.1 pad 1.78)
  other vias: 56.64,33.15
N$76  (via drill 1.1 pad 1.78)
  other vias: 56.64,28.07
N$77  (via drill 1.1 pad 1.78)
  other vias: 56.64,25.53
N$78  (via drill 1.1 pad 1.78)
  other vias: 56.64,22.99
N$79  (via drill 1.1 pad 1.78)
  other vias: 56.64,20.45
N$80  (via drill 1.1 pad 1.78)
  other vias: 56.64,17.91
N$81  (via drill 1.1 pad 1.78)
  other vias: 56.64,15.37
N$82  (via drill 1.1 pad 1.78)
  other vias: 56.64,12.83
N$83  (via drill 1.1 pad 1.78)
  other vias: 56.64,10.29
N$84  (via drill 1.1 pad 1.78)
  other vias: 54.1,10.29
N$85  (via drill 1.1 pad 1.78)
  other vias: 51.56,10.29
N$86  (via drill 1.1 pad 1.78)
  other vias: 51.56,12.83
N$87  (via drill 1.1 pad 1.78)
  other vias: 54.1,12.83
N$88  (via drill 1.1 pad 1.78)
  other vias: 54.1,15.37
N$89  (via drill 1.1 pad 1.78)
  other vias: 51.56,15.37
N$90  (via drill 1.1 pad 1.78)
  other vias: 51.56,17.91
N$91  (via drill 1.1 pad 1.78)
  other vias: 54.1,17.91
N$92  (via drill 1.1 pad 1.78)
  other vias: 54.1,20.45
N$93  (via drill 1.1 pad 1.78)
  other vias: 51.56,20.45
N$94  (via drill 1.1 pad 1.78)
  other vias: 51.56,22.99
N$95  (via drill 1.1 pad 1.78)
  other vias: 54.1,22.99
N$96  (via drill 1.1 pad 1.78)
  other vias: 54.1,25.53
N$97  (via drill 1.1 pad 1.78)
  other vias: 51.56,25.53
N$98  (via drill 1.1 pad 1.78)
  other vias: 51.56,28.07
N$99  (via drill 1.1 pad 1.78)
  other vias: 54.1,28.07
N$100  (via drill 1.1 pad 1.78)
  other vias: 54.1,30.61
N$101  (via drill 1.1 pad 1.78)
  other vias: 51.56,30.61
N$102  (via drill 1.1 pad 1.78)
  other vias: 51.56,33.15
N$103  (via drill 1.1 pad 1.78)
  other vias: 54.1,33.15
N$104  (via drill 1.1 pad 1.78)
  other vias: 54.1,35.69
N$105  (via drill 1.1 pad 1.78)
  other vias: 51.56,35.69
N$106  (via drill 1.1 pad 1.78)
  other vias: 51.56,38.23
N$107  (via drill 1.1 pad 1.78)
  other vias: 54.1,38.23
N$108  (via drill 1.1 pad 1.78)
  other vias: 54.1,40.77
N$109  (via drill 1.1 pad 1.78)
  other vias: 51.56,40.77
N$110  (via drill 1.1 pad 1.78)
  other vias: 51.56,43.31
N$111  (via drill 1.1 pad 1.78)
  other vias: 54.1,43.31
N$112  (via drill 1.1 pad 1.78)
  other vias: 49.02,43.31
N$113  (via drill 1.1 pad 1.78)
  other vias: 49.02,40.77
N$114  (via drill 1.1 pad 1.78)
  other vias: 49.02,38.23
N$115  (via drill 1.1 pad 1.78)
  other vias: 49.02,35.69
N$116  (via drill 1.1 pad 1.78)
  other vias: 49.02,33.15
N$117  (via drill 1.1 pad 1.78)
  other vias: 49.02,28.07
N$118  (via drill 1.1 pad 1.78)
  other vias: 49.02,30.61
N$119  (via drill 1.1 pad 1.78)
  other vias: 49.02,25.53
N$120  (via drill 1.1 pad 1.78)
  other vias: 49.02,22.99
N$121  (via drill 1.1 pad 1.78)
  other vias: 49.02,17.91
N$122  (via drill 1.1 pad 1.78)
  other vias: 49.02,15.37
N$123  (via drill 1.1 pad 1.78)
  other vias: 49.02,12.83
N$124  (via drill 1.1 pad 1.78)
  other vias: 49.02,10.29
N$125  (via drill 1.1 pad 1.78)
  other vias: 49.02,20.45
N$126  (via drill 1.1 pad 1.78)
  other vias: 46.48,10.29
N$127  (via drill 1.1 pad 1.78)
  other vias: 46.48,12.83
N$128  (via drill 1.1 pad 1.78)
  other vias: 46.48,15.37
N$129  (via drill 1.1 pad 1.78)
  other vias: 46.48,17.91
N$130  (via drill 1.1 pad 1.78)
  other vias: 46.48,20.45
N$131  (via drill 1.1 pad 1.78)
  other vias: 46.48,22.99
N$132  (via drill 1.1 pad 1.78)
  other vias: 46.48,25.53
N$133  (via drill 1.1 pad 1.78)
  other vias: 46.48,28.07
N$134  (via drill 1.1 pad 1.78)
  other vias: 46.48,30.61
N$135  (via drill 1.1 pad 1.78)
  other vias: 46.48,33.15
N$136  (via drill 1.1 pad 1.78)
  other vias: 46.48,35.69
N$137  (via drill 1.1 pad 1.78)
  other vias: 46.48,38.23
N$138  (via drill 1.1 pad 1.78)
  other vias: 46.48,40.77
N$139  (via drill 1.1 pad 1.78)
  other vias: 46.48,43.31
N$140  (via drill 1.1 pad 1.78)
  other vias: 43.94,43.31
N$141  (via drill 1.1 pad 1.78)
  other vias: 43.94,40.77
N$142  (via drill 1.1 pad 1.78)
  other vias: 43.94,38.23
N$143  (via drill 1.1 pad 1.78)
  other vias: 43.94,35.69
N$144  (via drill 1.1 pad 1.78)
  other vias: 43.94,33.15
N$145  (via drill 1.1 pad 1.78)
  other vias: 43.94,30.61
N$146  (via drill 1.1 pad 1.78)
  other vias: 43.94,28.07
N$147  (via drill 1.1 pad 1.78)
  other vias: 43.94,25.53
N$148  (via drill 1.1 pad 1.78)
  other vias: 43.94,22.99
N$149  (via drill 1.1 pad 1.78)
  other vias: 43.94,17.91
N$150  (via drill 1.1 pad 1.78)
  other vias: 43.94,20.45
N$151  (via drill 1.1 pad 1.78)
  other vias: 43.94,15.37
N$152  (via drill 1.1 pad 1.78)
  other vias: 43.94,12.83
N$153  (via drill 1.1 pad 1.78)
  other vias: 43.94,10.29
N$154  (via drill 1.1 pad 1.78)
  other vias: 41.4,10.29
N$155  (via drill 1.1 pad 1.78)
  other vias: 41.4,12.83
N$156  (via drill 1.1 pad 1.78)
  other vias: 41.4,15.37
N$157  (via drill 1.1 pad 1.78)
  other vias: 41.4,17.91
N$158  (via drill 1.1 pad 1.78)
  other vias: 41.4,20.45
N$159  (via drill 1.1 pad 1.78)
  other vias: 41.4,22.99
N$160  (via drill 1.1 pad 1.78)
  other vias: 41.4,25.53
N$161  (via drill 1.1 pad 1.78)
  other vias: 41.4,28.07
N$162  (via drill 1.1 pad 1.78)
  other vias: 41.4,30.61
N$163  (via drill 1.1 pad 1.78)
  other vias: 41.4,33.15
N$164  (via drill 1.1 pad 1.78)
  other vias: 41.4,35.69
N$165  (via drill 1.1 pad 1.78)
  other vias: 41.4,38.23
N$166  (via drill 1.1 pad 1.78)
  other vias: 41.4,40.77
N$167  (via drill 1.1 pad 1.78)
  other vias: 41.4,43.31
N$168  (via drill 1.1 pad 1.78)
  other vias: 38.86,43.31
N$169  (via drill 1.1 pad 1.78)
  other vias: 36.32,43.31
N$170  (via drill 1.1 pad 1.78)
  other vias: 33.78,43.31
N$171  (via drill 1.1 pad 1.78)
  other vias: 31.24,43.31
N$172  (via drill 1.1 pad 1.78)
  other vias: 31.24,40.77
N$173  (via drill 1.1 pad 1.78)
  other vias: 31.24,38.23
N$174  (via drill 1.1 pad 1.78)
  other vias: 31.24,35.69
N$175  (via drill 1.1 pad 1.78)
  other vias: 31.24,33.15
N$176  (via drill 1.1 pad 1.78)
  other vias: 31.24,30.61
N$177  (via drill 1.1 pad 1.78)
  other vias: 31.24,28.07
N$178  (via drill 1.1 pad 1.78)
  other vias: 31.24,25.53
N$179  (via drill 1.1 pad 1.78)
  other vias: 31.24,22.99
N$180  (via drill 1.1 pad 1.78)
  other vias: 31.24,20.45
N$181  (via drill 1.1 pad 1.78)
  other vias: 31.24,17.91
N$182  (via drill 1.1 pad 1.78)
  other vias: 31.24,15.37
N$183  (via drill 1.1 pad 1.78)
  other vias: 31.24,12.83
N$184  (via drill 1.1 pad 1.78)
  other vias: 31.24,10.29
N$185  (via drill 1.1 pad 1.78)
  other vias: 33.78,10.29
N$186  (via drill 1.1 pad 1.78)
  other vias: 33.78,12.83
N$187  (via drill 1.1 pad 1.78)
  other vias: 36.32,10.29
N$188  (via drill 1.1 pad 1.78)
  other vias: 38.86,10.29
N$189  (via drill 1.1 pad 1.78)
  other vias: 38.86,12.83
N$190  (via drill 1.1 pad 1.78)
  other vias: 36.32,12.83
N$191  (via drill 1.1 pad 1.78)
  other vias: 33.78,15.37
N$192  (via drill 1.1 pad 1.78)
  other vias: 36.32,15.37
N$193  (via drill 1.1 pad 1.78)
  other vias: 38.86,15.37
N$194  (via drill 1.1 pad 1.78)
  other vias: 38.86,17.91
N$195  (via drill 1.1 pad 1.78)
  other vias: 36.32,17.91
N$196  (via drill 1.1 pad 1.78)
  other vias: 33.78,17.91
N$197  (via drill 1.1 pad 1.78)
  other vias: 33.78,20.45
N$198  (via drill 1.1 pad 1.78)
  other vias: 36.32,20.45
N$199  (via drill 1.1 pad 1.78)
  other vias: 38.86,20.45
N$200  (via drill 1.1 pad 1.78)
  other vias: 38.86,22.99
N$201  (via drill 1.1 pad 1.78)
  other vias: 36.32,22.99
N$202  (via drill 1.1 pad 1.78)
  other vias: 33.78,22.99
N$203  (via drill 1.1 pad 1.78)
  other vias: 33.78,25.53
N$204  (via drill 1.1 pad 1.78)
  other vias: 36.32,25.53
N$205  (via drill 1.1 pad 1.78)
  other vias: 38.86,25.53
N$206  (via drill 1.1 pad 1.78)
  other vias: 38.86,28.07
N$207  (via drill 1.1 pad 1.78)
  other vias: 36.32,28.07
N$208  (via drill 1.1 pad 1.78)
  other vias: 33.78,28.07
N$209  (via drill 1.1 pad 1.78)
  other vias: 33.78,30.61
N$210  (via drill 1.1 pad 1.78)
  other vias: 33.78,33.15
N$211  (via drill 1.1 pad 1.78)
  other vias: 33.78,35.69
N$212  (via drill 1.1 pad 1.78)
  other vias: 33.78,38.23
N$213  (via drill 1.1 pad 1.78)
  other vias: 33.78,40.77
N$214  (via drill 1.1 pad 1.78)
  other vias: 36.32,40.77
N$215  (via drill 1.1 pad 1.78)
  other vias: 38.86,40.77
N$216  (via drill 1.1 pad 1.78)
  other vias: 38.86,38.23
N$217  (via drill 1.1 pad 1.78)
  other vias: 36.32,38.23
N$218  (via drill 1.1 pad 1.78)
  other vias: 36.32,35.69
N$219  (via drill 1.1 pad 1.78)
  other vias: 38.86,30.61
N$220  (via drill 1.1 pad 1.78)
  other vias: 38.86,35.69
N$221  (via drill 1.1 pad 1.78)
  other vias: 38.86,33.15
N$222  (via drill 1.1 pad 1.78)
  other vias: 36.32,33.15
N$223  (via drill 1.1 pad 1.78)
  other vias: 36.32,30.61
PAIR_2
  Top 0.254: R5.2 19.75,16.32 17.78,18.29 17.41,18.29 SW1.4 SW1.2
PAIR_BTN
  Top 0.254: U1.9 20.07,20.5 R5.1
PAIR_LED
  Top 0.254: U1.32 11.15,34.19 10.16,35.18 7.11,35.18 5.08,37.21 R2.2
RTS
  Top 0.305: U1.24 23.15,34.64 22.35,35.43 22.35,36.32 SJ1.1
RTS/DTR
  Top 0.254: SJ1.2 25.4,36.45 25.53,36.32
  Top 0.305: SJ1.2 23.88,37.72 24.64,38.48 27.37,38.48 C2.2
RXD  (via drill 0.5)
  Top 0.254: U1.2 v9.65,22.99 | v12.95,41.27 10.98,41.27 10.98,40.77
  Top 0.305: LED4.C 1.4,49.5 1.4,51.05 2.29,51.94 6.1,51.94 6.22,51.82 6.22,46.35 6.73,45.85 6.73,42.54 9.65,42.54 10.98,41.21 10.98,40.77 IC1.4
  Bottom 0.254: v9.65,22.99 12.95,26.29 v12.95,41.27
RXD_5V  (via drill 0.5)
  Top 0.254: R6.2 12.83,37.34 | IC1.3 11.01,37.59 12.19,37.59 R6.2 | v13.84,37.34 R6.2 | v12.32,44.96 13.46,46.1 SW2.P2
  Bottom 0.254: v12.32,44.96 13.84,43.43 v13.84,37.34
SPI_CLK
  Top 0.305: JP5.2 28.58,29.46 28.7,29.59 28.26,29.59 U1.19
SPI_CS
  Top 0.254: JP5.5 23.62,22.99 25.4,22.99 27.34,24.93 U1.16
SPI_MISO
  Top 0.254: JP5.3 22.48,26.92 23.75,28.19 26.04,28.19 26.3,27.93 U1.18
SPI_MOSI
  Top 0.305: JP5.4 25.26,26.43 U1.17
SRX  (via drill 0.5)
  Top 0.254: v11.81,48.77 13.43,48.77 SW2.S2
  Bottom 0.254: JP1.4 24.64,41.78 22.61,41.78 22.35,42.04 22.35,43.81 21.34,44.83 15.75,44.83 v11.81,48.77
STATE  (via drill 0.5)
  Top 0.254: U1.10 21.65,22.17 v20.32,23.5
  Bottom 0.254: v20.32,23.5 18.03,25.78 18.03,41.27 18.54,41.78 JP1.1
STX  (via drill 0.5)
  Top 0.254: v10.79,50.16 9.23,48.6 SW2.S1
  Bottom 0.254: JP1.3 21.59,45.34 17.53,45.34 12.7,50.16 v10.79,50.16
TXD  (via drill 0.39, 0.5)
  Top 0.254: v1.27,46.1 1.27,44.83 | v13.97,44.96 14.79,44.96 R7.1
  Top 0.305: LED3.C 1.94,45.5 1.27,44.83 1.27,37.72 8.15,30.84 U1.1
  Bottom 0.254: v1.27,46.1 1.52,46.35 12.57,46.35 v13.97,44.96

### Text on the board
tPlace: Soft / Serial | TX | RX | Conn | 3Vo | STX | SRX | DSR | Direct | Reset | Conn | RTS | DTR | Pair | Bluefruit EZ-Link / Bluetooth Shield / & programmer | v1.1 | Reset